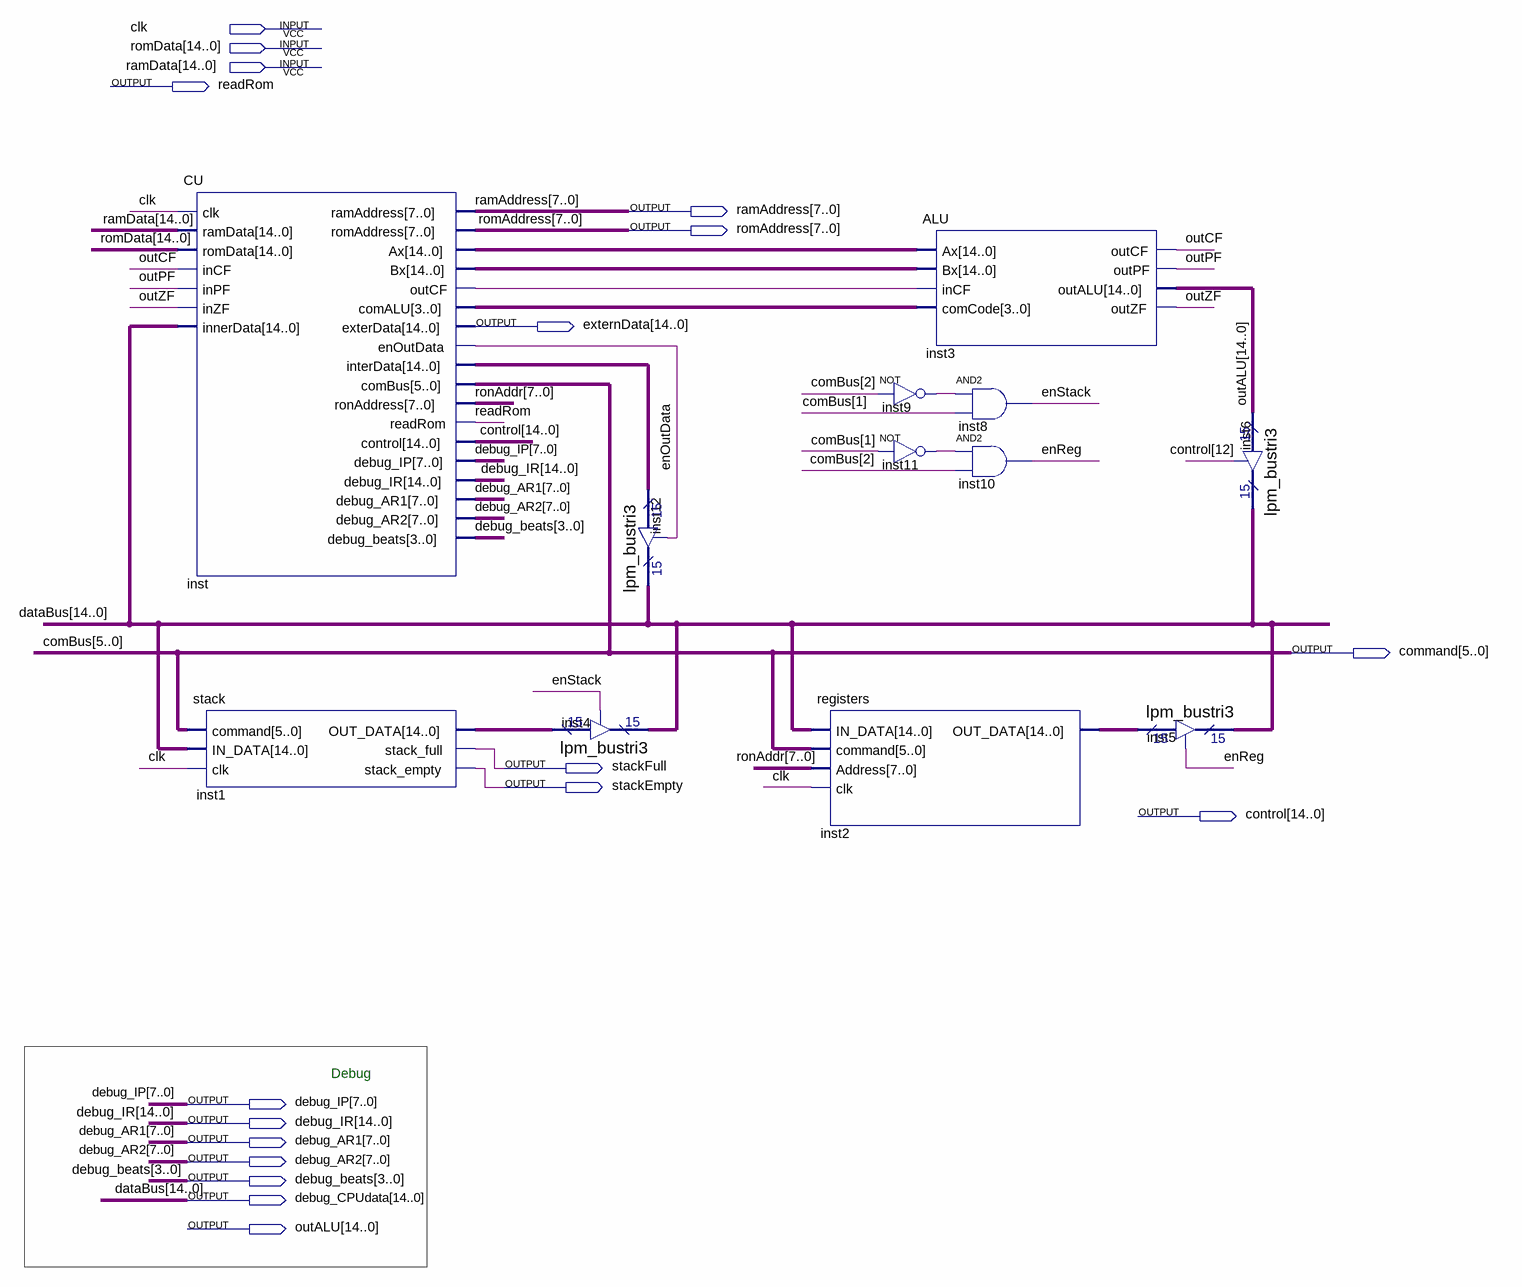
[diagram p0: schematic sheet]
// Quartus schematic CPU.bdf as structural Verilog: 12 symbols, 18 pins
module CPU (
  input  clk,
  input  [14:0] romData,
  input  [14:0] ramData,
  output readRom,
  output [7:0] ramAddress,
  output [7:0] romAddress,
  output [14:0] externData,
  output [5:0] command,
  output stackFull,
  output stackEmpty,
  output [14:0] control,
  output [7:0] debug_IP,
  output [14:0] debug_IR,
  output [7:0] debug_AR1,
  output [7:0] debug_AR2,
  output [3:0] debug_beats,
  output [14:0] debug_CPUdata,
  output [14:0] outALU
);

  wire enOutData, enReg, enStack, inst9_out, inst11_out, inst_outcf, outCF, outPF, outZF;
  wire [3:0] inst_comalu;
  wire [7:0] ronAddr;
  wire [14:0] inst1_out_data, inst2_out_data, inst_ax, inst_bx, inst_interdata;

  CU inst (
    .clk(clk), .ramData(ramData), .romData(romData), .inCF(outCF), .inPF(outPF), .inZF(outZF),
    .innerData(debug_CPUdata), .ramAddress(ramAddress), .romAddress(romAddress), .Ax(inst_ax), .Bx(inst_bx),
    .outCF(inst_outcf), .comALU(inst_comalu), .exterData(externData), .enOutData(enOutData),
    .interData(inst_interdata), .comBus(command), .ronAddress(ronAddr), .readRom(readRom), .control(control),
    .debug_IP(debug_IP), .debug_IR(debug_IR), .debug_AR1(debug_AR1), .debug_AR2(debug_AR2),
    .debug_beats(debug_beats));
  stack inst1 (
    .command(command), .IN_DATA(debug_CPUdata), .clk(clk), .OUT_DATA(inst1_out_data), .stack_full(stackFull),
    .stack_empty(stackEmpty));
  lpm_bustri3 inst4 (.enabledt(enStack), .data(inst1_out_data), .tridata(debug_CPUdata));
  lpm_bustri3 inst12 (.enabledt(enOutData), .data(inst_interdata), .tridata(debug_CPUdata));
  registers inst2 (.IN_DATA(debug_CPUdata), .command(command), .Address(ronAddr), .clk(clk), .OUT_DATA(inst2_out_data));
  not inst9 (inst9_out, command[2]);
  not inst11 (inst11_out, command[1]);
  ALU inst3 (
    .Ax(inst_ax), .Bx(inst_bx), .inCF(inst_outcf), .comCode(inst_comalu), .outCF(outCF), .outPF(outPF),
    .outALU(outALU), .outZF(outZF));
  and inst8 (enStack, inst9_out, command[1]);
  and inst10 (enReg, inst11_out, command[2]);
  lpm_bustri3 inst5 (.enabledt(enReg), .data(inst2_out_data), .tridata(debug_CPUdata));
  lpm_bustri3 inst6 (.enabledt(control[12]), .data(outALU), .tridata(debug_CPUdata));

  // Other names for the same wires on the sheet: comBus[5:0] = command; dataBus[14:0] = debug_CPUdata

  // Notes on the sheet:
  //   Debug
endmodule
